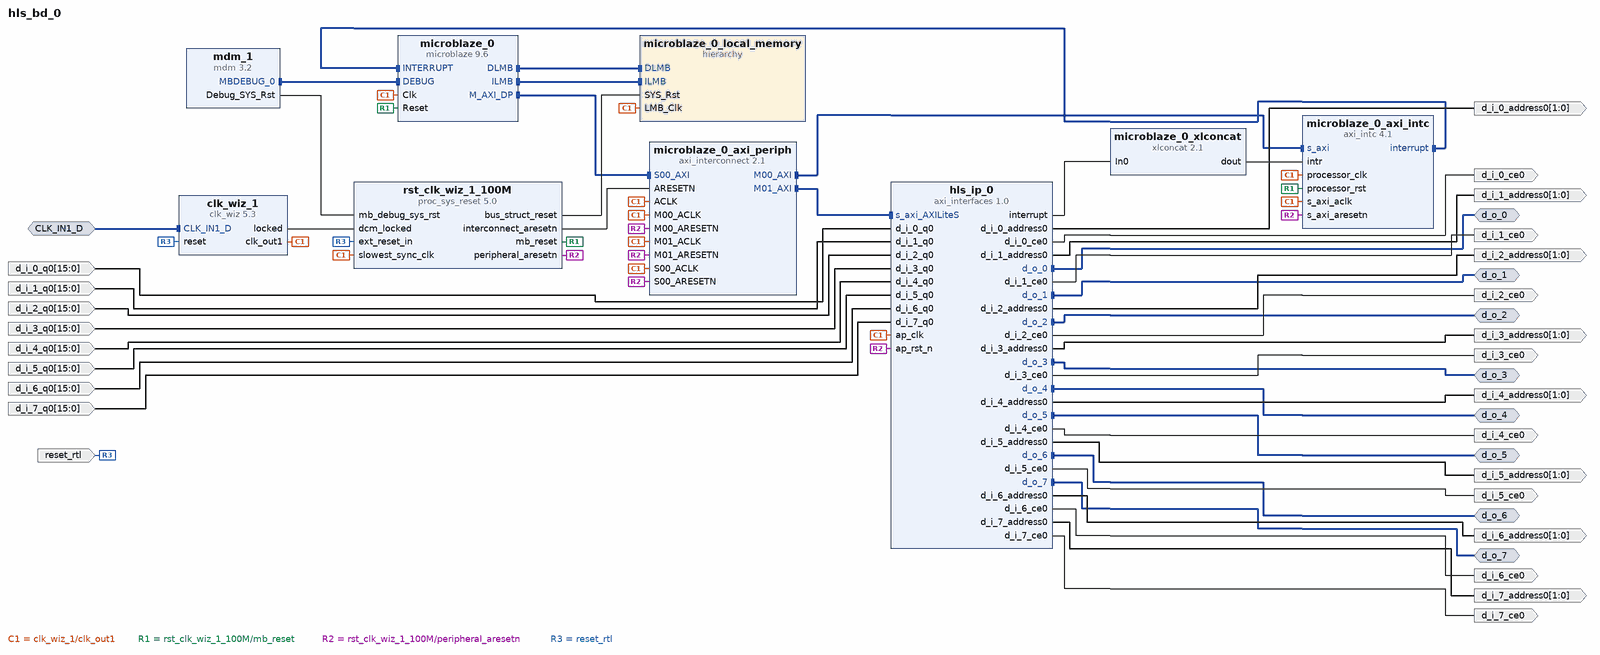
[diagram p0: block diagram of the top level]
# Vivado block design hls_bd_0, Vivado 2016.1
create_bd_design hls_bd_0

create_bd_intf_port -mode Slave -vlnv xilinx.com:interface:diff_clock_rtl:1.0 CLK_IN1_D
create_bd_intf_port -mode Master -vlnv xilinx.com:interface:axis_rtl:1.0 d_o_0
set_property -dict {CONFIG.FREQ_HZ 100000000 CONFIG.PHASE 0.000} [get_bd_intf_ports d_o_0]
create_bd_intf_port -mode Master -vlnv xilinx.com:interface:axis_rtl:1.0 d_o_1
set_property -dict {CONFIG.FREQ_HZ 100000000 CONFIG.PHASE 0.000} [get_bd_intf_ports d_o_1]
create_bd_intf_port -mode Master -vlnv xilinx.com:interface:axis_rtl:1.0 d_o_2
set_property -dict {CONFIG.FREQ_HZ 100000000 CONFIG.PHASE 0.000} [get_bd_intf_ports d_o_2]
create_bd_intf_port -mode Master -vlnv xilinx.com:interface:axis_rtl:1.0 d_o_3
set_property -dict {CONFIG.FREQ_HZ 100000000 CONFIG.PHASE 0.000} [get_bd_intf_ports d_o_3]
create_bd_intf_port -mode Master -vlnv xilinx.com:interface:axis_rtl:1.0 d_o_4
set_property -dict {CONFIG.FREQ_HZ 100000000 CONFIG.PHASE 0.000} [get_bd_intf_ports d_o_4]
create_bd_intf_port -mode Master -vlnv xilinx.com:interface:axis_rtl:1.0 d_o_5
set_property -dict {CONFIG.FREQ_HZ 100000000 CONFIG.PHASE 0.000} [get_bd_intf_ports d_o_5]
create_bd_intf_port -mode Master -vlnv xilinx.com:interface:axis_rtl:1.0 d_o_6
set_property -dict {CONFIG.FREQ_HZ 100000000 CONFIG.PHASE 0.000} [get_bd_intf_ports d_o_6]
create_bd_intf_port -mode Master -vlnv xilinx.com:interface:axis_rtl:1.0 d_o_7
set_property -dict {CONFIG.FREQ_HZ 100000000 CONFIG.PHASE 0.000} [get_bd_intf_ports d_o_7]
create_bd_port -dir I -type rst reset_rtl
set_property -dict {CONFIG.POLARITY ACTIVE_HIGH} [get_bd_ports reset_rtl]
create_bd_port -dir O -from 1 -to 0 -type data d_i_0_address0
create_bd_port -dir O -type data d_i_0_ce0
create_bd_port -dir I -from 15 -to 0 -type data d_i_0_q0
create_bd_port -dir O -from 1 -to 0 -type data d_i_1_address0
create_bd_port -dir O -type data d_i_1_ce0
create_bd_port -dir I -from 15 -to 0 -type data d_i_1_q0
create_bd_port -dir O -from 1 -to 0 -type data d_i_2_address0
create_bd_port -dir O -type data d_i_2_ce0
create_bd_port -dir I -from 15 -to 0 -type data d_i_2_q0
create_bd_port -dir O -from 1 -to 0 -type data d_i_3_address0
create_bd_port -dir O -type data d_i_3_ce0
create_bd_port -dir I -from 15 -to 0 -type data d_i_3_q0
create_bd_port -dir O -from 1 -to 0 -type data d_i_4_address0
create_bd_port -dir O -type data d_i_4_ce0
create_bd_port -dir I -from 15 -to 0 -type data d_i_4_q0
create_bd_port -dir O -from 1 -to 0 -type data d_i_5_address0
create_bd_port -dir O -type data d_i_5_ce0
create_bd_port -dir I -from 15 -to 0 -type data d_i_5_q0
create_bd_port -dir O -from 1 -to 0 -type data d_i_6_address0
create_bd_port -dir O -type data d_i_6_ce0
create_bd_port -dir I -from 15 -to 0 -type data d_i_6_q0
create_bd_port -dir O -from 1 -to 0 -type data d_i_7_address0
create_bd_port -dir O -type data d_i_7_ce0
create_bd_port -dir I -from 15 -to 0 -type data d_i_7_q0

create_bd_cell -type ip -vlnv xilinx.com:hls:axi_interfaces:1.0 hls_ip_0
create_bd_cell -type ip -vlnv xilinx.com:ip:microblaze:9.6 microblaze_0
set_property -dict {CONFIG.C_D_AXI 1 CONFIG.C_D_LMB 1 CONFIG.C_I_LMB 1 CONFIG.C_DEBUG_ENABLED 1} [get_bd_cells microblaze_0]
create_bd_cell -type hier microblaze_0_local_memory
create_bd_cell -type ip -vlnv xilinx.com:ip:axi_interconnect:2.1 microblaze_0_axi_periph
set_property -dict {CONFIG.NUM_MI 2} [get_bd_cells microblaze_0_axi_periph]
create_bd_cell -type ip -vlnv xilinx.com:ip:axi_intc:4.1 microblaze_0_axi_intc
set_property -dict {CONFIG.C_HAS_FAST 1} [get_bd_cells microblaze_0_axi_intc]
create_bd_cell -type ip -vlnv xilinx.com:ip:xlconcat:2.1 microblaze_0_xlconcat
set_property -dict {CONFIG.NUM_PORTS 1} [get_bd_cells microblaze_0_xlconcat]
create_bd_cell -type ip -vlnv xilinx.com:ip:mdm:3.2 mdm_1
create_bd_cell -type ip -vlnv xilinx.com:ip:clk_wiz:5.3 clk_wiz_1
set_property -dict {CONFIG.PRIM_SOURCE Differential_clock_capable_pin} [get_bd_cells clk_wiz_1]
create_bd_cell -type ip -vlnv xilinx.com:ip:proc_sys_reset:5.0 rst_clk_wiz_1_100M

# ---- hierarchy /microblaze_0_local_memory ----
current_bd_instance /microblaze_0_local_memory
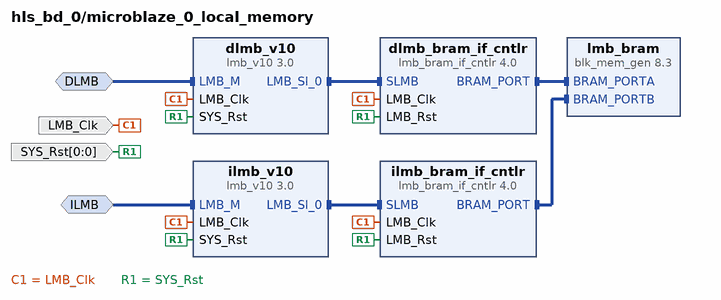
[diagram p1: block diagram inside /microblaze_0_local_memory]
create_bd_intf_pin -mode MirroredMaster -vlnv xilinx.com:interface:lmb_rtl:1.0 DLMB
create_bd_intf_pin -mode MirroredMaster -vlnv xilinx.com:interface:lmb_rtl:1.0 ILMB
create_bd_pin -dir I -type clk LMB_Clk
create_bd_pin -dir I -from 0 -to 0 -type rst SYS_Rst

create_bd_cell -type ip -vlnv xilinx.com:ip:lmb_v10:3.0 dlmb_v10
create_bd_cell -type ip -vlnv xilinx.com:ip:lmb_v10:3.0 ilmb_v10
create_bd_cell -type ip -vlnv xilinx.com:ip:lmb_bram_if_cntlr:4.0 dlmb_bram_if_cntlr
set_property -dict {CONFIG.C_ECC 0} [get_bd_cells dlmb_bram_if_cntlr]
create_bd_cell -type ip -vlnv xilinx.com:ip:lmb_bram_if_cntlr:4.0 ilmb_bram_if_cntlr
set_property -dict {CONFIG.C_ECC 0} [get_bd_cells ilmb_bram_if_cntlr]
create_bd_cell -type ip -vlnv xilinx.com:ip:blk_mem_gen:8.3 lmb_bram
set_property -dict {CONFIG.Memory_Type True_Dual_Port_RAM CONFIG.use_bram_block BRAM_Controller} [get_bd_cells lmb_bram]

# ---- connections ----

current_bd_instance /microblaze_0_local_memory
connect_bd_intf_net -intf_net microblaze_0_dlmb_bus [get_bd_intf_pins dlmb_v10/LMB_Sl_0] [get_bd_intf_pins dlmb_bram_if_cntlr/SLMB]
connect_bd_intf_net -intf_net microblaze_0_ilmb_bus [get_bd_intf_pins ilmb_v10/LMB_Sl_0] [get_bd_intf_pins ilmb_bram_if_cntlr/SLMB]
connect_bd_intf_net -intf_net microblaze_0_dlmb_cntlr [get_bd_intf_pins dlmb_bram_if_cntlr/BRAM_PORT] [get_bd_intf_pins lmb_bram/BRAM_PORTA]
connect_bd_intf_net -intf_net microblaze_0_ilmb_cntlr [get_bd_intf_pins ilmb_bram_if_cntlr/BRAM_PORT] [get_bd_intf_pins lmb_bram/BRAM_PORTB]
connect_bd_intf_net -intf_net microblaze_0_dlmb [get_bd_intf_pins DLMB] [get_bd_intf_pins dlmb_v10/LMB_M]
connect_bd_intf_net -intf_net microblaze_0_ilmb [get_bd_intf_pins ILMB] [get_bd_intf_pins ilmb_v10/LMB_M]
connect_bd_net -net microblaze_0_Clk [get_bd_pins LMB_Clk] \
  [get_bd_pins dlmb_v10/LMB_Clk] [get_bd_pins dlmb_bram_if_cntlr/LMB_Clk] [get_bd_pins ilmb_v10/LMB_Clk] \
  [get_bd_pins ilmb_bram_if_cntlr/LMB_Clk]
connect_bd_net [get_bd_pins SYS_Rst] \
  [get_bd_pins dlmb_v10/SYS_Rst] [get_bd_pins dlmb_bram_if_cntlr/LMB_Rst] [get_bd_pins ilmb_v10/SYS_Rst] \
  [get_bd_pins ilmb_bram_if_cntlr/LMB_Rst]

current_bd_instance /
connect_bd_intf_net [get_bd_intf_pins microblaze_0/DLMB] [get_bd_intf_pins microblaze_0_local_memory/DLMB]
connect_bd_intf_net [get_bd_intf_pins microblaze_0/ILMB] [get_bd_intf_pins microblaze_0_local_memory/ILMB]
connect_bd_intf_net -intf_net microblaze_0_axi_dp [get_bd_intf_pins microblaze_0_axi_periph/S00_AXI] [get_bd_intf_pins microblaze_0/M_AXI_DP]
connect_bd_intf_net [get_bd_intf_pins microblaze_0_axi_intc/interrupt] [get_bd_intf_pins microblaze_0/INTERRUPT]
connect_bd_intf_net -intf_net microblaze_0_intc_axi [get_bd_intf_pins microblaze_0_axi_periph/M00_AXI] [get_bd_intf_pins microblaze_0_axi_intc/s_axi]
connect_bd_intf_net [get_bd_intf_pins mdm_1/MBDEBUG_0] [get_bd_intf_pins microblaze_0/DEBUG]
connect_bd_intf_net [get_bd_intf_pins microblaze_0_axi_periph/M01_AXI] [get_bd_intf_pins hls_ip_0/s_axi_AXILiteS]
connect_bd_intf_net [get_bd_intf_ports CLK_IN1_D] [get_bd_intf_pins clk_wiz_1/CLK_IN1_D]
connect_bd_intf_net [get_bd_intf_ports d_o_0] [get_bd_intf_pins hls_ip_0/d_o_0]
connect_bd_intf_net [get_bd_intf_ports d_o_1] [get_bd_intf_pins hls_ip_0/d_o_1]
connect_bd_intf_net [get_bd_intf_ports d_o_2] [get_bd_intf_pins hls_ip_0/d_o_2]
connect_bd_intf_net [get_bd_intf_ports d_o_3] [get_bd_intf_pins hls_ip_0/d_o_3]
connect_bd_intf_net [get_bd_intf_ports d_o_4] [get_bd_intf_pins hls_ip_0/d_o_4]
connect_bd_intf_net [get_bd_intf_ports d_o_5] [get_bd_intf_pins hls_ip_0/d_o_5]
connect_bd_intf_net [get_bd_intf_ports d_o_6] [get_bd_intf_pins hls_ip_0/d_o_6]
connect_bd_intf_net [get_bd_intf_ports d_o_7] [get_bd_intf_pins hls_ip_0/d_o_7]
connect_bd_net -net microblaze_0_intr [get_bd_pins microblaze_0_xlconcat/dout] [get_bd_pins microblaze_0_axi_intc/intr]
connect_bd_net -net microblaze_0_Clk [get_bd_pins clk_wiz_1/clk_out1] \
  [get_bd_pins microblaze_0/Clk] [get_bd_pins microblaze_0_axi_periph/ACLK] [get_bd_pins microblaze_0_axi_periph/S00_ACLK] \
  [get_bd_pins microblaze_0_axi_periph/M00_ACLK] [get_bd_pins microblaze_0_axi_intc/s_axi_aclk] \
  [get_bd_pins microblaze_0_axi_intc/processor_clk] [get_bd_pins microblaze_0_local_memory/LMB_Clk] \
  [get_bd_pins rst_clk_wiz_1_100M/slowest_sync_clk] [get_bd_pins hls_ip_0/ap_clk] \
  [get_bd_pins microblaze_0_axi_periph/M01_ACLK]
connect_bd_net [get_bd_pins clk_wiz_1/locked] [get_bd_pins rst_clk_wiz_1_100M/dcm_locked]
connect_bd_net [get_bd_pins rst_clk_wiz_1_100M/mb_reset] [get_bd_pins microblaze_0/Reset] [get_bd_pins microblaze_0_axi_intc/processor_rst]
connect_bd_net [get_bd_pins rst_clk_wiz_1_100M/bus_struct_reset] [get_bd_pins microblaze_0_local_memory/SYS_Rst]
connect_bd_net [get_bd_pins rst_clk_wiz_1_100M/interconnect_aresetn] [get_bd_pins microblaze_0_axi_periph/ARESETN]
connect_bd_net [get_bd_pins rst_clk_wiz_1_100M/peripheral_aresetn] \
  [get_bd_pins microblaze_0_axi_periph/S00_ARESETN] [get_bd_pins microblaze_0_axi_periph/M00_ARESETN] \
  [get_bd_pins microblaze_0_axi_intc/s_axi_aresetn] [get_bd_pins hls_ip_0/ap_rst_n] \
  [get_bd_pins microblaze_0_axi_periph/M01_ARESETN]
connect_bd_net [get_bd_pins mdm_1/Debug_SYS_Rst] [get_bd_pins rst_clk_wiz_1_100M/mb_debug_sys_rst]
connect_bd_net [get_bd_ports reset_rtl] [get_bd_pins rst_clk_wiz_1_100M/ext_reset_in] [get_bd_pins clk_wiz_1/reset]
connect_bd_net [get_bd_pins hls_ip_0/d_i_0_address0] [get_bd_ports d_i_0_address0]
connect_bd_net [get_bd_pins hls_ip_0/d_i_0_ce0] [get_bd_ports d_i_0_ce0]
connect_bd_net -net d_i_0_q0_1 [get_bd_ports d_i_0_q0] [get_bd_pins hls_ip_0/d_i_0_q0]
connect_bd_net [get_bd_pins hls_ip_0/d_i_1_address0] [get_bd_ports d_i_1_address0]
connect_bd_net [get_bd_pins hls_ip_0/d_i_1_ce0] [get_bd_ports d_i_1_ce0]
connect_bd_net -net d_i_1_q0_1 [get_bd_ports d_i_1_q0] [get_bd_pins hls_ip_0/d_i_1_q0]
connect_bd_net [get_bd_pins hls_ip_0/d_i_2_address0] [get_bd_ports d_i_2_address0]
connect_bd_net [get_bd_pins hls_ip_0/d_i_2_ce0] [get_bd_ports d_i_2_ce0]
connect_bd_net -net d_i_2_q0_1 [get_bd_ports d_i_2_q0] [get_bd_pins hls_ip_0/d_i_2_q0]
connect_bd_net [get_bd_pins hls_ip_0/d_i_3_address0] [get_bd_ports d_i_3_address0]
connect_bd_net [get_bd_pins hls_ip_0/d_i_3_ce0] [get_bd_ports d_i_3_ce0]
connect_bd_net -net d_i_3_q0_1 [get_bd_ports d_i_3_q0] [get_bd_pins hls_ip_0/d_i_3_q0]
connect_bd_net [get_bd_pins hls_ip_0/d_i_4_address0] [get_bd_ports d_i_4_address0]
connect_bd_net [get_bd_pins hls_ip_0/d_i_4_ce0] [get_bd_ports d_i_4_ce0]
connect_bd_net -net d_i_4_q0_1 [get_bd_ports d_i_4_q0] [get_bd_pins hls_ip_0/d_i_4_q0]
connect_bd_net [get_bd_pins hls_ip_0/d_i_5_address0] [get_bd_ports d_i_5_address0]
connect_bd_net [get_bd_pins hls_ip_0/d_i_5_ce0] [get_bd_ports d_i_5_ce0]
connect_bd_net -net d_i_5_q0_1 [get_bd_ports d_i_5_q0] [get_bd_pins hls_ip_0/d_i_5_q0]
connect_bd_net [get_bd_pins hls_ip_0/d_i_6_address0] [get_bd_ports d_i_6_address0]
connect_bd_net [get_bd_pins hls_ip_0/d_i_6_ce0] [get_bd_ports d_i_6_ce0]
connect_bd_net -net d_i_6_q0_1 [get_bd_ports d_i_6_q0] [get_bd_pins hls_ip_0/d_i_6_q0]
connect_bd_net [get_bd_pins hls_ip_0/d_i_7_address0] [get_bd_ports d_i_7_address0]
connect_bd_net [get_bd_pins hls_ip_0/d_i_7_ce0] [get_bd_ports d_i_7_ce0]
connect_bd_net -net d_i_7_q0_1 [get_bd_ports d_i_7_q0] [get_bd_pins hls_ip_0/d_i_7_q0]
connect_bd_net [get_bd_pins hls_ip_0/interrupt] [get_bd_pins microblaze_0_xlconcat/In0]

# ---- address map ----
assign_bd_address -offset 0x00000000 -range 8K -target_address_space [get_bd_addr_spaces microblaze_0/Data] [get_bd_addr_segs microblaze_0_local_memory/dlmb_bram_if_cntlr/SLMB/Mem]
assign_bd_address -offset 0x41200000 -range 64K -target_address_space [get_bd_addr_spaces microblaze_0/Data] [get_bd_addr_segs microblaze_0_axi_intc/s_axi/Reg]
assign_bd_address -offset 0x44A00000 -range 64K -target_address_space [get_bd_addr_spaces microblaze_0/Data] [get_bd_addr_segs hls_ip_0/s_axi_AXILiteS/Reg]
assign_bd_address -offset 0x00000000 -range 8K -target_address_space [get_bd_addr_spaces microblaze_0/Instruction] [get_bd_addr_segs microblaze_0_local_memory/ilmb_bram_if_cntlr/SLMB/Mem]

validate_bd_design
save_bd_design
